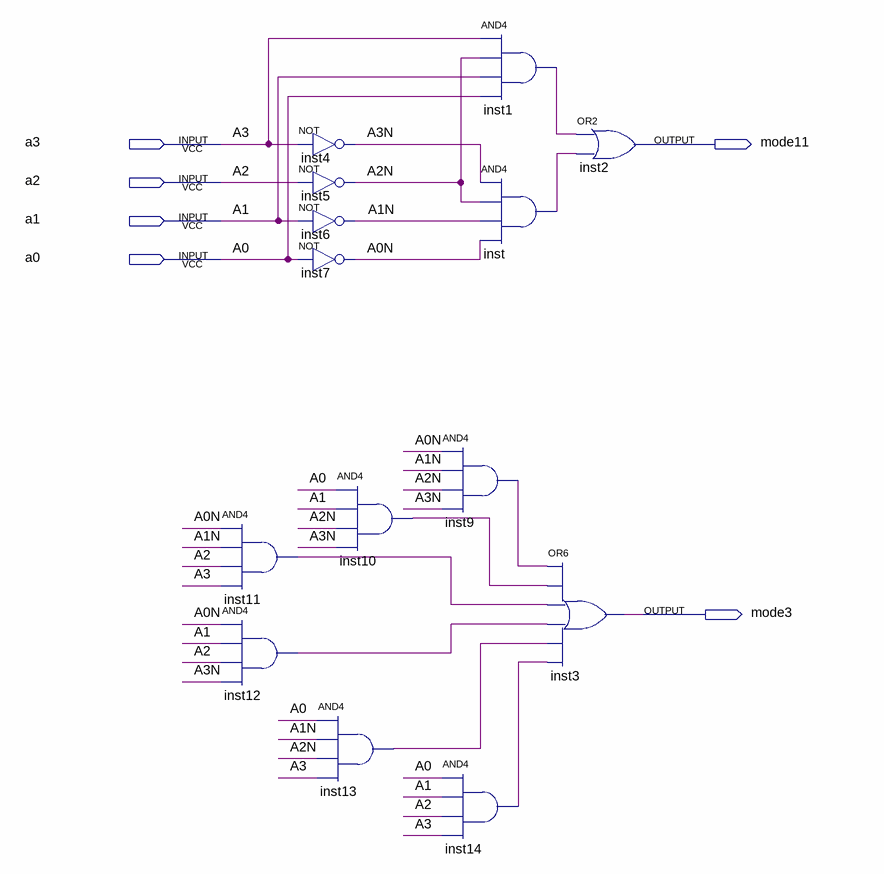
[diagram p0: schematic sheet]
// Quartus schematic mode3_11.bdf as structural Verilog: 14 symbols, 6 pins
module mode3_11 (
  input  a3,
  input  a2,
  input  a1,
  input  a0,
  output mode11,
  output mode3
);

  wire A0N, A1N, A2N, A3N, inst1_out, inst9_out, inst10_out, inst11_out, inst12_out, inst13_out, inst14_out,
       inst_out;

  and inst11 (inst11_out, A0N, A1N, a2, a3);
  and inst12 (inst12_out, A0N, a1, a2, A3N);
  not inst4 (A3N, a3);
  not inst5 (A2N, a2);
  not inst6 (A1N, a1);
  not inst7 (A0N, a0);
  and inst13 (inst13_out, a0, A1N, A2N, a3);
  and inst10 (inst10_out, a0, a1, A2N, A3N);
  and inst9 (inst9_out, A0N, A1N, A2N, A3N);
  and inst14 (inst14_out, a0, a1, a2, a3);
  and inst1 (inst1_out, a3, A2N, a1, a0);
  and inst (inst_out, A3N, A2N, A1N, A0N);
  or inst3 (mode3, inst9_out, inst10_out, inst11_out, inst12_out, inst13_out, inst14_out);
  or inst2 (mode11, inst1_out, inst_out);
endmodule
